# EAGLE design Power_24V-3A (EAGLE 7.6.0)
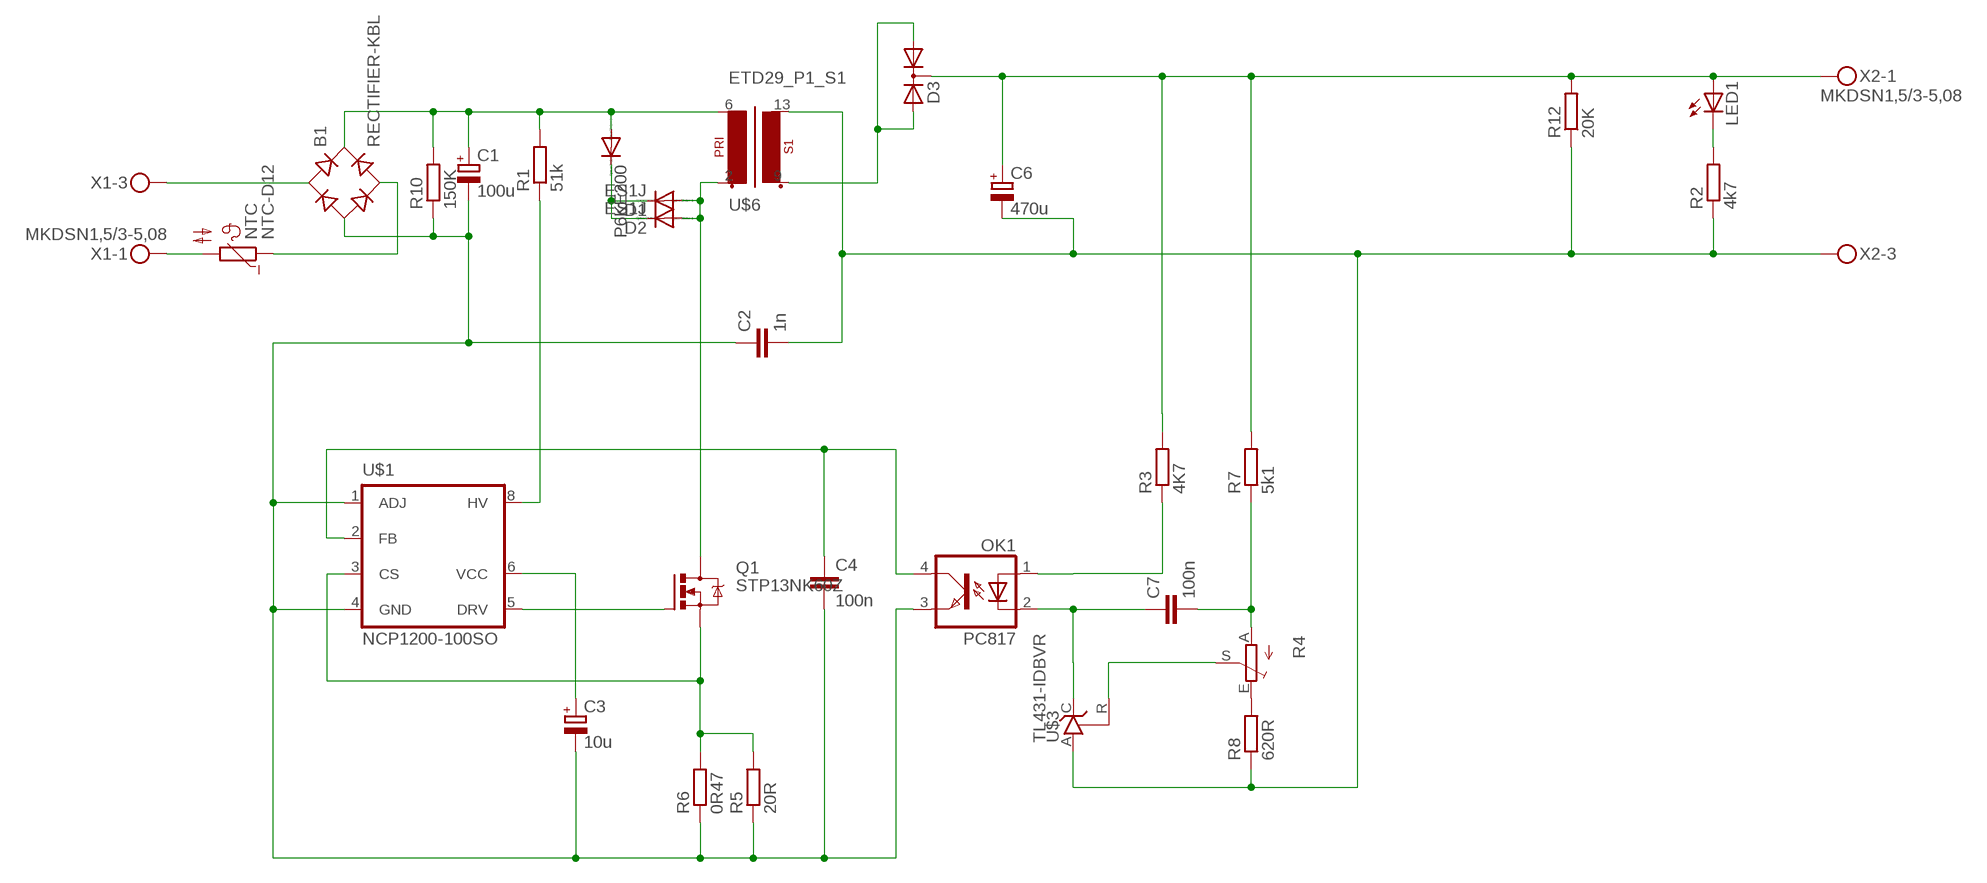
[diagram p0: schematic, sheet 1]

## Parts
B1  RECTIFIER-KBL  [KBL]
C1  100u  CPOL-EUE10-22.5  [EB22,5D]
C2  1n  C-EU050-024X044  [C050-024X044]
C3  10u  CPOL-EUE5-5  [E5-5]
C4  100n  C-EUC0805  [C0805]
C6  470u  CPOL-EUE5-10.5  [E5-10,5]
C7  100n  C-EUC0805  [C0805]
D1  ES1J  DIODE-DO41-7.6  [DO41-7.6]
D2  ES1J  DIODE-DO41-7.6  [DO41-7.6]
D3  DIODE-2AC|CATO220V  [TO220ABS]
LED1  LED5MM  [LED5MM]
NTC  NTC-D12  [NTC-D12]
OK1  PC817  [DIL04]
P6KE200  DIODE-DO15-12  [DO15-12]
Q1  STP13NK60Z  IRF740  [TO220BV]
R1  51k  R_SQP-5  [SQP-5]
R2  4k7  R-EU_R1206  [R1206]
R3  4K7  R-EU_R1206  [R1206]
R4  TRIM_EU-S75H  [S75H]
R5  20R  R-EU_0411/12  [0411/12]
R6  0R47  R-EU_0411/12  [0411/12]
R7  5k1  R-EU_R1206  [R1206]
R8  620R  R-EU_R1206  [R1206]
R10  150K  R-EU_0207/10  [0207/10]
R12  20K  R-EU_R1206  [R1206]
U$1  NCP1200-100SO  [SOP8]
U$3  TL431-IDBVR  [SOT23-5]
U$6  ETD29_P1_S1  [ETD29]
X1  MKDSN1,5/3-5,08  [MKDSN1,5/3-5,08]
X2  MKDSN1,5/3-5,08  [MKDSN1,5/3-5,08]

## Nets
N$1: NTC.2 X1.1
N$2: B1.AC1 X1.3
N$3: B1.AC2 NTC.1
N$4: Q1.S R5.2 R6.2 U$1.3(CS)
N$5: B1.- C1.- C2.1 C3.- C4.2 OK1.3(EMIT) R5.1 R6.1 R10.1 U$1.1(ADJ) U$1.4(GND)
N$6: B1.+ C1.+ P6KE200.A R1.2 R10.2 U$6.6(P1-2)
N$7: D1.C D2.C P6KE200.C
N$8: D1.A D2.A Q1.D U$6.2(P1-1)
N$9: C2.2 C6.- R2.1 R8.1 R12.1 U$3.A U$6.13(S1-2) X2.3
N$10: R1.1 U$1.8(HV)
N$11: Q1.G U$1.5(DRV)
N$12: D3.A1 D3.A2 U$6.9(S1-1)
N$13: LED1.K(C) R2.2
N$14: C3.+ U$1.6(VCC)
N$15: C4.1 OK1.4(COL) U$1.2(FB)
N$18: C6.+ D3.C LED1.A R3.2 R7.2 R12.2 X2.1
N$19: R4.S U$3.R
N$20: OK1.1(A) R3.1
N$31: C7.1 OK1.2(C) U$3.C
N$32: C7.2 R4.A R7.1
N$33: R4.E R8.2
Unconnected: X1.2 X2.2

## Library data of the parts
B1 = rectifier:RECTIFIER-: Rectifier
C1 C3 C6 = rcl:CPOL-EU: POLARIZED CAPACITOR, European symbol
C2 C4 C7 = rcl:C-EU: CAPACITOR, European symbol
D1 D2 P6KE200 = diode:DIODE-: DIODE
D3 = diode:DIODE-2AC|CA: Dual DIODE Anode-Cathode|Cathode-Anode
LED1 = led:LED: LED OSRAM: - CHIPLED LG R971, LG N971, LY N971, LG Q971, LY Q971, LO R971, LY R971 LH N974, LH R974 LS Q976, LO Q976, LY Q976 LO Q996 - Hyper CHIPLED LW Q18S LB Q993, LB Q99A, LB R99A - SideLED LS A670, LO A670, LY A670, LG A670, LP A670 LB A673, LV A673, LT A673, LW A673 LH A674 LY A675 LS A676, LA A676, LO A676, LY A676, LW A676 LS A679, LY A679, LG A679 - Hyper Micro SIDELED® LS Y876, LA Y876, LO Y876, LY Y876 LT Y87S - SmartLED LW L88C, LW L88S LB L89C, LB L89S, LG L890 LS L89K, LO L89K, LY L89K LS L896, LA L896, LO L896, LY L896 - TOPLED LS T670, LO T670, LY T670, LG T670, LP T670 LSG T670, LSP T670, LSY T670, LOP T670, LYG T670 LG T671, LOG T671, LSG T671 LB T673, LV T673, LT T673, LW T673 LH T674 LS T676, LA T676, LO T676, LY T676, LB T676, LH T676, LSB T676, LW T676 LB T67C, LV T67C, LT T67C, LS T67K, LO T67K, LY T67K, LW E67C LS E67B, LA E67B, LO E67B, LY E67B, LB E67C, LV E67C, LT E67C LW T67C LS T679, LY T679, LG T679 LS T770, LO T770, LY T770, LG T770, LP T770 LB T773, LV T773, LT T773, LW T773 LH T774 LS E675, LA E675, LY E675, LS T675 LS T776, LA T776, LO T776, LY T776, LB T776 LHGB T686 LT T68C, LB T68C - Hyper Mini TOPLED® LB M676 - Mini TOPLED Santana® LG M470 LS M47K, LO M47K, LY M47K Source: http://www.osram.convergy.de LUXEON: - LUMILED® LXK2-PW12-R00, LXK2-PW12-S00, LXK2-PW14-U00, LXK2-PW14-V00 LXK2-PM12-R00, LXK2-PM12-S00, LXK2-PM14-U00 LXK2-PE12-Q00, LXK2-PE12-R00, LXK2-PE12-S00, LXK2-PE14-T00, LXK2-PE14-U00 LXK2-PB12-K00, LXK2-PB12-L00, LXK2-PB12-M00, LXK2-PB14-N00, LXK2-PB14-P00, LXK2-PB14-Q00 LXK2-PR12-L00, LXK2-PR12-M00, LXK2-PR14-Q00, LXK2-PR14-R00 LXK2-PD12-Q00, LXK2-PD12-R00, LXK2-PD12-S00 LXK2-PH12-R00, LXK2-PH12-S00 LXK2-PL12-P00, LXK2-PL12-Q00, LXK2-PL12-R00 Source: www.luxeon.com KINGBRIGHT: KA-3528ASYC Source: www.kingbright.com
NTC = Namenlos:NTC-D12
OK1 = optocoupler:PC817: SHARP OPTO COUPLER; MPN: PC817X4J000F; OC_FARNELL: 9707727; OC_NEWARK: 97K7059
Q1 = transistor-power:IRF740: N-CHANNEL MOS FET
R1 = Namenlos:R_SQP-5
R2 R3 R5-R8 R10 R12 = rcl:R-EU_: RESISTOR, European symbol
R4 = pot:TRIM_EU-: POTENTIOMETER
U$1 = NCP1200:NCP1200-100
U$3 = TL431:TL431-IDBVR
U$6 = _Transformers:ETD29_P1_S1
X1 X2 = Namenlos:MKDSN1,5/3-5,08: MKDSN 1,5/ 3-5,08 Printklemme Nennstrom: 13,5 A Nennspannung: 250 V Rastermaß: 5,08 mm Polzahl: 3 Anschlussart: Schraubanschluss Montage: Löten Anschlussrichtung Leiter/Platine: 0 ° Artikelnummer: 1729131 Source: http://eshop.phoenixcontact.com .. 1729131.pdf

## Board
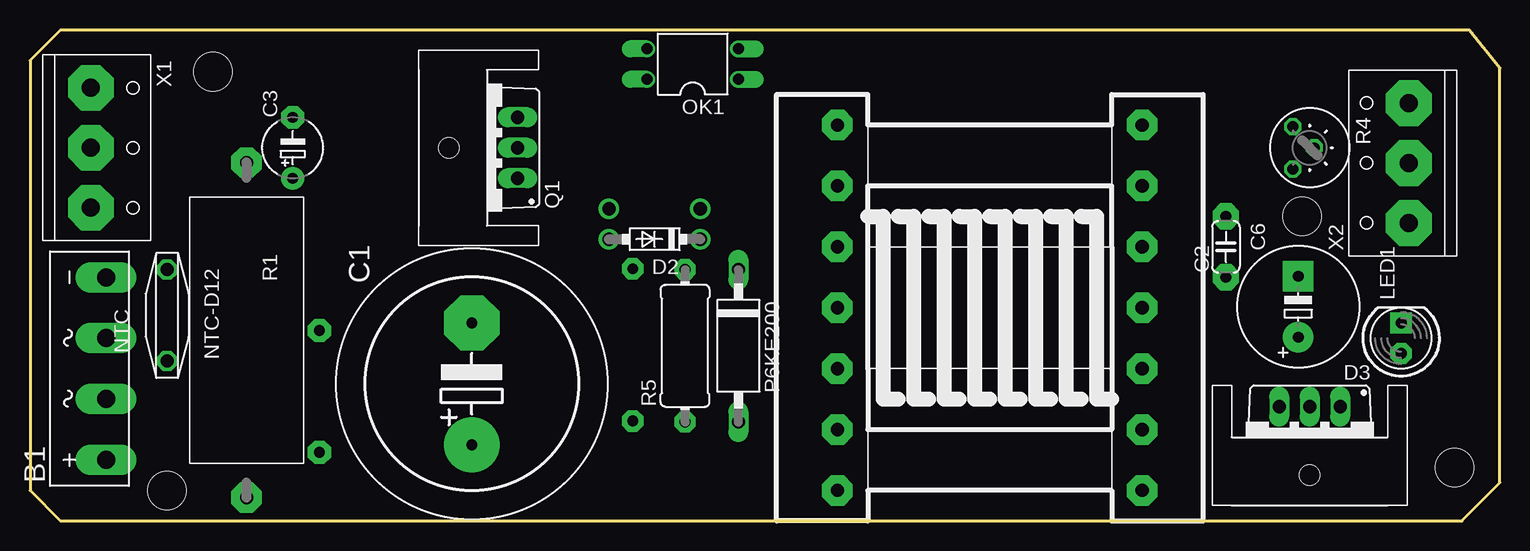
[diagram p1: board, top side]
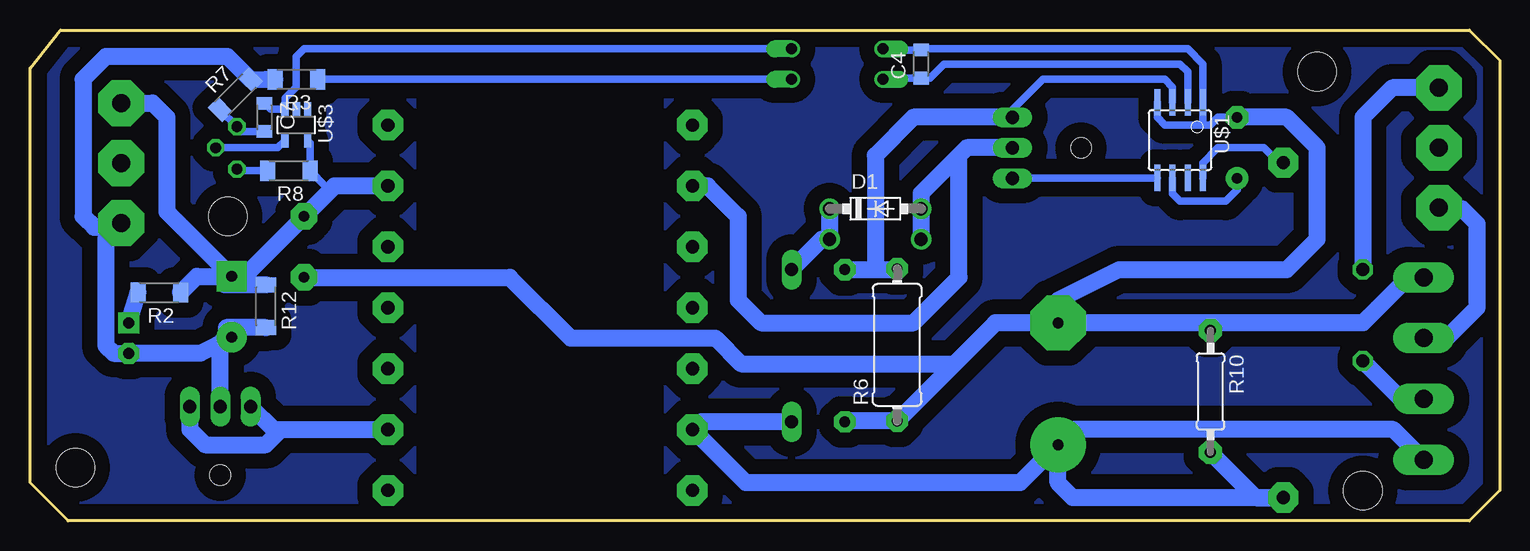
[diagram p2: board, bottom side, seen from below]

Size 122.53 x 40.95 mm. Coordinates in mm from the lower left corner, seen from the top.
Outline: 0,38.41 0,2.54 2.54,0 119.36,0 122.53,3.17 122.53,37.77 120,40.95 2.54,40.95 0,38.41
Copper layers (1*16): Top 0.035mm / dielectric 1.5mm / Bottom 0.035mm
Design rules "default": minimum track width 10mil, minimum drill 24mil, track to track 8mil, track to pad 8mil, pad to pad 8mil, via to via 8mil, smd to smd 8mil, copper to edge 40mil, drill to drill 8mil, minimum pad ring 10mil, minimum via ring 8mil, stop-mask expansion 4mil, vias tented up to drill 0mil, thermal gap 10mil
Holes 3.2 mm at 15.24,37.46 11.43,2.54 106.04,25.4 118.75,4.45

### Footprints (pad centres in the part's own frame; a part is rotated, then mirrored left to right if it is on the bottom)
KBL = drill 1.5 pad 2.54 long: + -7.62,-1.27; - 7.62,-1.27; AC1 2.54,-1.27; AC2 -2.54,-1.27
EB22,5D = drill 0.9 pad 4.597: + -5.08,0 | drill 0.9 pad 4.597 octagon: - 5.08,0
C050-024X044 = drill 0.9 pad 2.184 octagon: 1 -2.54,0; 2 2.54,0
E5-5 = drill 0.9 pad 1.905: + -2.54,0 | drill 0.9 pad 1.905 octagon: - 2.54,0
C0805 = smd 1.05 x 1.3: 1 -1.175,0; 2 1.175,0
E5-10,5 = drill 0.9 pad 2.54: + -2.54,0 | drill 0.9 pad 2.54 square: - 2.54,0
DO41-7.6 = drill 1.1 pad 1.7: A 3.81,0; C -3.81,0
TO220ABS = drill 1.1 pad 1.422 long: A1 -2.54,-2.54; A2 2.54,-2.54; C 0,-2.54
LED5MM = drill 0.9 pad 1.778 octagon: A -1.27,0 | drill 0.9 pad 1.778 square: K 1.27,0
NTC-D12 = drill 1.1 pad 1.676 octagon: 1 -3.81,0; 2 3.81,0
DIL04 = drill 0.9 pad 1.27 offset: 1 -1.27,-3.81; 2 1.27,-3.81; 3 1.27,3.81; 4 -1.27,3.81
DO15-12 = drill 1.1 pad 1.676 long: A 6.35,0; C -6.35,0
TO220BV = drill 1.1 pad 1.422 long: D 0,-2.54; G -2.54,-2.54; S 2.54,-2.54
SQP-5 = drill 1.1 pad 2.54 octagon: 1 -13.97,0; 2 13.97,0
R1206 = smd 1.25 x 1.7: 1 -1.775,0; 2 1.775,0
S75H = drill 0.9 pad 1.422 octagon: A -1.778,-1.397; E 1.778,-1.397; S 0,0.381
0411/12 = drill 0.9 pad 1.778 octagon: 1 -6.35,0; 2 6.35,0
0207/10 = drill 0.9 pad 1.93 octagon: 1 -5.08,0; 2 5.08,0
SOP8 = smd 0.5 x 2.2: 1 -1.905,-3.154; 2 -0.645,-3.154; 3 0.625,-3.154; 4 1.895,-3.154; 5 1.905,3.154; 6 0.635,3.154; 7 -0.635,3.154; 8 -1.905,3.154
SOT23-5 = smd 0.6 x 1.2: + 0,-2.576; A -0.95,0.036; C 0.95,-2.576; NC -0.95,-2.576; R 0.95,0.036
SK95-3M3_HOLE = hole 1.7: 0,3.175
ETD29 = drill 1.1 pad 2.54 octagon: 1 -15.24,-12.7; 2 -10.16,-12.7; 3 -5.08,-12.7; 4 0,-12.7; 5 5.08,-12.7; 6 10.16,-12.7; 7 15.24,-12.7; 8 15.24,12.7; 9 10.16,12.7; 10 5.08,12.7; 11 0,12.7; 12 -5.08,12.7; 13 -10.16,12.7; 14 -15.24,12.7
MKDSN1,5/3-5,08 = drill 1.5 pad 3.81 octagon: 1 -5,0; 2 0,0; 3 5,0

### Placement (x,y rotation side)
B1  5.08,12.7 90 top
C1  36.83,11.43 90 top
C2  99.69,22.86 90 top
C3  21.91,31.12 90 top
C4  48.26,38.1 90 bottom
C6  105.72,17.86 90 top
C7  103,33.66 270 bottom
D1  52.07,26.03 0 bottom
D2  52.07,23.49 180 top
D3  106.68,6.99 180 top
LED1  114.3,15.24 90 top
NTC  11.43,17.14 90 top
OK1  55.25,38.1 90 top
P6KE200  59.05,14.61 270 top
Q1  38.1,31.12 90 top
R1  18.06,15.91 270 top
R2  111.76,19.05 180 bottom
R3  100.33,36.83 180 bottom
R4  106.68,31.12 270 top
R5  54.61,14.61 90 top
R6  50.24,14.68 90 bottom
R7  105.41,35.56 45 bottom
R8  100.97,29.21 180 bottom
R10  24.13,10.79 270 bottom
R12  102.87,17.91 270 bottom
U$1  26.67,31.75 180 bottom
U$3  100.33,31.75 180 bottom
U$4  [SK95-3M3_HOLE]  38.1,31.12 90 top
U$5  [SK95-3M3_HOLE]  106.68,6.99 180 top
U$6  80.01,17.78 270 top
X1  5.08,31.12 270 top
X2  114.94,29.84 90 top

### Tracks (layer width: path | path; a pad name or v marks a point on that pad's centre or on a via)
N$1
  Bottom 1.422: X1.1 8.97,36.12 11.43,33.66 NTC.2
N$2
  Bottom 1.422: B1.AC1 4.45,15.24 1.91,17.78 1.91,24.77 3.17,26.03 5,26.03 X1.3
N$3
  Bottom 1.422: B1.AC2 8.25,10.16 NTC.1
N$4
  Bottom 0.61: U$1.3 27.29,36.19 27.94,36.83 38.1,36.83 40.64,34.29 Q1.S
  Bottom 1.422: Q1.S 48.89,33.66 52.07,30.48 52.07,20.95 | 52.07,20.95 50.32,20.95 R6.2 | R5.2 52.07,20.95
N$5
  Bottom 0.61: C3.- 23.49,33.66 24.13,33.02 24.77,33.02 | 24.77,33.02 27.94,33.02 28.58,33.66 28.58,34.89 U$1.4 | 24.77,33.02 U$1.1 24.77,38.1 26.03,39.37 48.16,39.37 C4.2 51.34,39.27 OK1.3 | R10.1 24.13,16.51
  Bottom 1.422: B1.- 7.62,20.32 11.43,16.51 24.13,16.51 C1.- | C1.- 36.83,18.41 31.75,20.95 17.78,20.95 15.24,23.49 15.24,31.12 17.78,33.66 C3.- | C1.- 42.06,16.51 45.48,13.1 | 45.48,13.1 R6.1 54.53,8.33 R5.1 | C2.1 82.55,20.32 77.47,15.24 65.41,15.24 63.26,13.1 45.48,13.1
N$6
  Bottom 1.422: C1.+ 36.83,3.17 35.6,1.94 R1.2 20.36,1.94 R10.2 | P6KE200.A 66.67,8.25 U$6.6 62.86,3.17 40,3.17 C1.+ | B1.+ 8.89,7.62 35.56,7.62 C1.+
N$7
  Bottom 1.422: D1.C D2.C 56.52,23.49 P6KE200.C
N$8
  Bottom 1.422: Q1.D 44.45,31.12 45.08,30.48 | 45.08,30.48 48.26,27.3 D1.A D2.A | U$6.2 66.04,27.94 63.5,25.4 63.5,18.41 61.59,16.51 48.89,16.51 45.08,20.32 45.08,30.48
N$9
  Bottom 0.61: U$3.A 99.19,31.52 R8.1 97.92,27.94 97.16,27.94
  Bottom 1.422: U$6.13 97.16,27.94 C2.2 105.41,19.68 | R12.1 105.41,19.68 | 105.41,19.68 106.28,19.68 C6.- | X2.3 112.31,34.84 111.12,33.66 111.12,25.8 C6.- | R2.1 108.64,20.4 C6.-
N$10
  Bottom 0.61: R1.1 18.06,29.49 19.68,31.12 23.49,31.12 24.77,29.84 U$1.8
N$11
  Bottom 0.61: U$1.5 40.62,28.6 Q1.G
N$12
  Bottom 1.422: D3.A2 102.23,7.62 101.6,7.62 | 101.6,7.62 U$6.9 | D3.A1 109.22,7.62 107.95,6.35 102.87,6.35 101.6,7.62
N$13
  Bottom 1.422: LED1.K R2.2
N$14
  Bottom 0.61: C3.+ 21.91,27.62 22.86,26.67 26.67,26.67 27.3,27.3 U$1.6
N$15
  Bottom 0.61: U$1.2 26.02,37.45 26.67,38.1 46.36,38.1 47.53,36.92 C4.1 51.34,36.92 OK1.4
N$17
  pour Bottom (isolate 1.27): 0,38.73 1.91,40.64 120.01,40.64 122.56,38.1 122.56,3.17 119.38,0 2.54,0 0,2.54
N$18
  Bottom 0.305: C6.+ 106.44,14.61 106.68,14.61
  Bottom 1.422: D3.C 106.68,14.61 106.68,14.86 | R12.2 106.18,16.13 C6.+ 108.34,13.97 LED1.A 115.57,13.97 116.2,14.61 116.2,23.58 115.29,24.49 | X2.1 115.29,24.49 | 115.29,24.49 117.2,24.49 118.11,25.4 118.11,36.83 116.2,38.73 106.07,38.73 R7.2 102.87,36.83 R3.2
N$19
  Bottom 0.61: U$3.R 101.88,31.12 R4.S
N$20
  Bottom 0.61: R3.1 OK1.1
N$28
  cutout Bottom (isolate 1.27): 69.85,0.63 69.85,41.27 90.17,40.64 90.17,0
N$31
  Bottom 0.61: C7.1 102.49,34.33 U$3.C 101.28,35.24 100.33,36.2 100.33,38.73 99.69,39.37 OK1.2
N$32
  Bottom 0.61: R4.A 105.31,32.92 | R4.A | C7.2 104.87,32.48 R4.A | 105.43,33.03 R4.A | R7.1 106.66,34.27 R4.A
N$33
  Bottom 0.61: R8.2 105.16,29.21 R4.E